# Altium schematic sheet IO.SchDoc
size A3
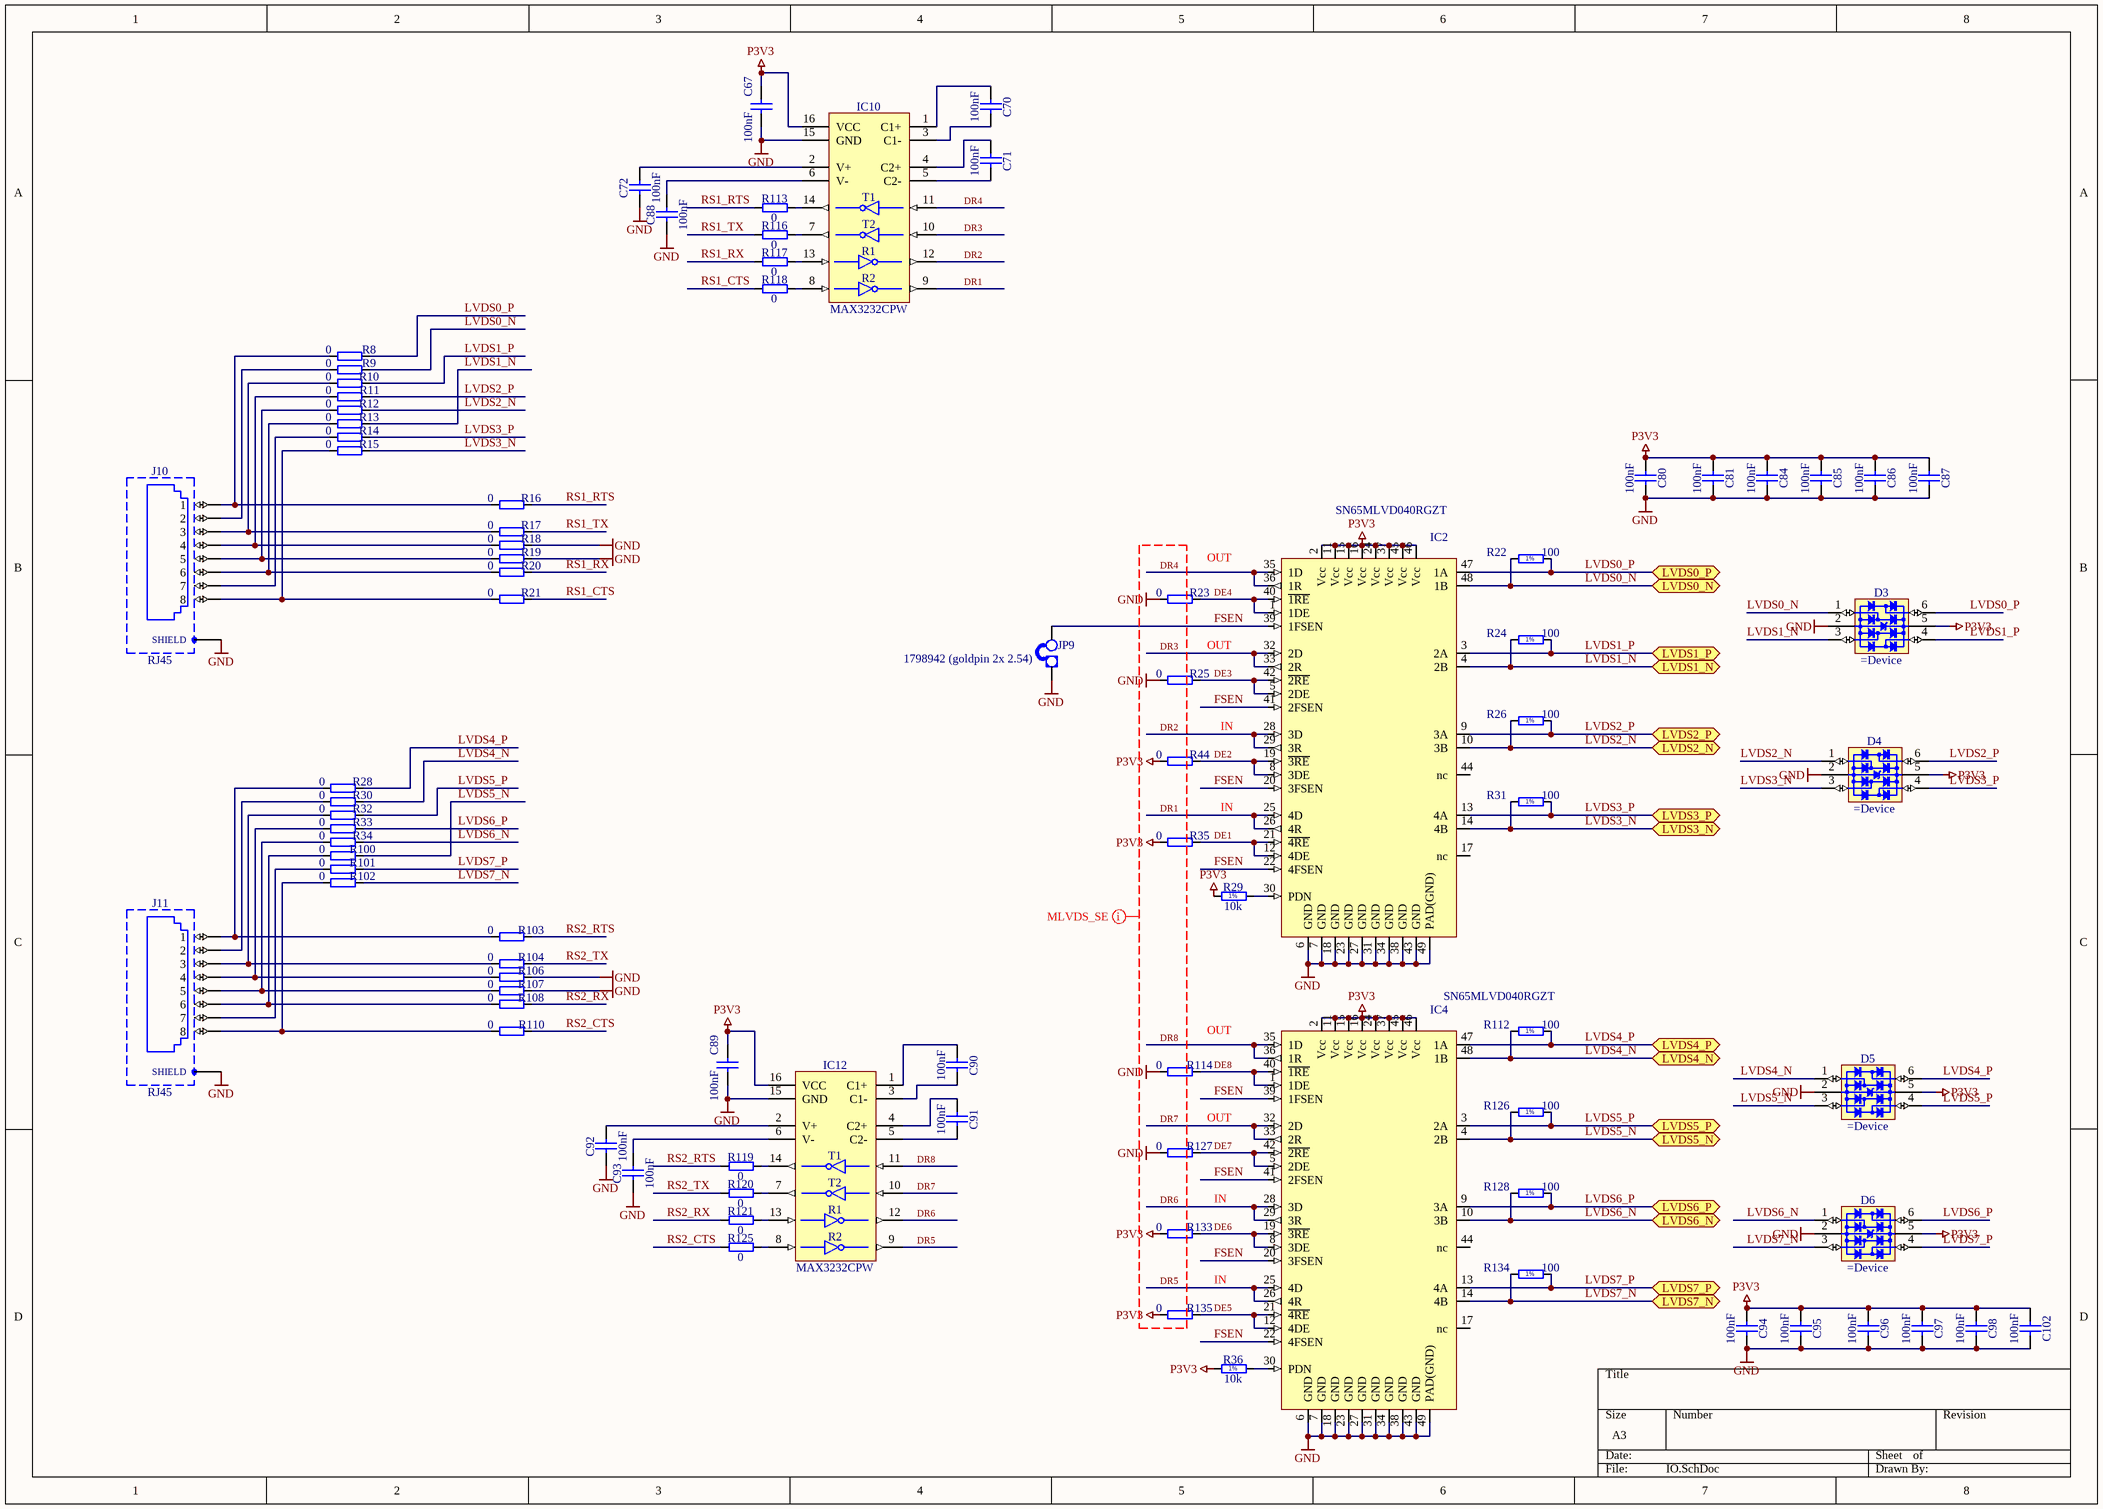
[diagram p0: IO.SchDoc]

## Parts
C67  100nF  [CAPC0603X33N]
C70  100nF  [CAPC1608X90N]
C71  100nF  [CAPC1608X90N]
C72  100nF  [CAPC1608X90N]
C80  100nF  [CAPC0603X33N]
C81  100nF  [CAPC0603X33N]
C84  100nF  [CAPC0603X33N]
C85  100nF  [CAPC0603X33N]
C86  100nF  [CAPC0603X33N]
C87  100nF  [CAPC0603X33N]
C88  100nF  [CAPC1608X90N]
C89  100nF  [CAPC0603X33N]
C90  100nF  [CAPC1608X90N]
C91  100nF  [CAPC1608X90N]
C92  100nF  [CAPC1608X90N]
C93  100nF  [CAPC1608X90N]
C94  100nF  [CAPC0603X33N]
C95  100nF  [CAPC0603X33N]
C96  100nF  [CAPC0603X33N]
C97  100nF  [CAPC0603X33N]
C98  100nF  [CAPC0603X33N]
C102  100nF  [CAPC0603X33N]
D3  (no value)  [SOTFL50P160X60-6N]
D4  (no value)  [SOTFL50P160X60-6N]
D5  (no value)  [SOTFL50P160X60-6N]
D6  (no value)  [SOTFL50P160X60-6N]
IC2  SN65MLVD040RGZT  [QFN48L]
IC4  SN65MLVD040RGZT  [QFN48L]
IC10  MAX3232CPW  [SOP65P640X120-16N]
IC12  MAX3232CPW  [SOP65P640X120-16N]
J10  RJ45  [FCI_95678-001LF]
J11  RJ45  [FCI_95678-001LF]
JP9  1798942 (goldpin 2x 2.54)  [jump]
R8  0  [RESC1005X40N]
R9  0  [RESC1005X40N]
R10  0  [RESC1005X40N]
R11  0  [RESC1005X40N]
R12  0  [RESC1005X40N]
R13  0  [RESC1005X40N]
R14  0  [RESC1005X40N]
R15  0  [RESC1005X40N]
R16  0  [RESC1005X40N]
R17  0  [RESC1005X40N]
R18  0  [RESC1005X40N]
R19  0  [RESC1005X40N]
R20  0  [RESC1005X40N]
R21  0  [RESC1005X40N]
R22  100  [RESC1005X40N]
R23  0  [RESC1005X40N]
R24  100  [RESC1005X40N]
R25  0  [RESC1005X40N]
R26  100  [RESC1005X40N]
R28  0  [RESC1005X40N]
R29  10k  [RESC1005X40N]
R30  0  [RESC1005X40N]
R31  100  [RESC1005X40N]
R32  0  [RESC1005X40N]
R33  0  [RESC1005X40N]
R34  0  [RESC1005X40N]
R35  0  [RESC1005X40N]
R36  10k  [RESC1005X40N]
R44  0  [RESC1005X40N]
R100  0  [RESC1005X40N]
R101  0  [RESC1005X40N]
R102  0  [RESC1005X40N]
R103  0  [RESC1005X40N]
R104  0  [RESC1005X40N]
R106  0  [RESC1005X40N]
R107  0  [RESC1005X40N]
R108  0  [RESC1005X40N]
R110  0  [RESC1005X40N]
R112  100  [RESC1005X40N]
R113  0  [RESC1005X40N]
R114  0  [RESC1005X40N]
R116  0  [RESC1005X40N]
R117  0  [RESC1005X40N]
R118  0  [RESC1005X40N]
R119  0  [RESC1005X40N]
R120  0  [RESC1005X40N]
R121  0  [RESC1005X40N]
R125  0  [RESC1005X40N]
R126  100  [RESC1005X40N]
R127  0  [RESC1005X40N]
R128  100  [RESC1005X40N]
R133  0  [RESC1005X40N]
R134  100  [RESC1005X40N]
R135  0  [RESC1005X40N]

## Ports
LVDS0_N (bidir), LVDS0_P (bidir), LVDS1_N (bidir), LVDS1_P (bidir), LVDS2_N (bidir), LVDS2_P (bidir), LVDS3_N (bidir), LVDS3_P (bidir), LVDS4_N (bidir), LVDS4_P (bidir), LVDS5_N (bidir), LVDS5_P (bidir), LVDS6_N (bidir), LVDS6_P (bidir), LVDS7_N (bidir), LVDS7_P (bidir)

## Nets
GND: C67.1 C72.2 C80.2 C81.2 C84.2 C85.2 C86.2 C87.2 C88.2 C89.1 C92.2 C93.2 C94.2 C95.2 C96.2 C97.2 C98.2 C102.2 D3.2(GND) D4.2(GND) D5.2(GND) D6.2(GND) IC2.6(GND) IC2.7(GND) IC2.18(GND) IC2.23(GND) IC2.27(GND) IC2.31(GND) IC2.34(GND) IC2.38(GND) IC2.43(GND) IC2.49(PAD(GND)) IC4.6(GND) IC4.7(GND) IC4.18(GND) IC4.23(GND) IC4.27(GND) IC4.31(GND) IC4.34(GND) IC4.38(GND) IC4.43(GND) IC4.49(PAD(GND)) IC10.15(GND) IC12.15(GND) J10.SHIELD J11.SHIELD JP9.1(E1) R18.2 R19.2 R23.1 R25.1 R106.2 R107.2 R114.1 R127.1
P3V3: C67.2 C80.1 C81.1 C84.1 C85.1 C86.1 C87.1 C89.2 C94.1 C95.1 C96.1 C97.1 C98.1 C102.1 D3.5(VBUS) D4.5(VBUS) D5.5(VBUS) D6.5(VBUS) IC2.2(Vcc) IC2.11(Vcc) IC2.15(Vcc) IC2.16(Vcc) IC2.24(Vcc) IC2.37(Vcc) IC2.45(Vcc) IC2.46(Vcc) IC4.2(Vcc) IC4.11(Vcc) IC4.15(Vcc) IC4.16(Vcc) IC4.24(Vcc) IC4.37(Vcc) IC4.45(Vcc) IC4.46(Vcc) IC10.16(VCC) IC12.16(VCC) R29.1 R35.1 R36.1 R44.1 R133.1 R135.1
DE1: IC2.12(4DE) IC2.21(~{4RE}) R35.2
DE2: IC2.8(3DE) IC2.19(~{3RE}) R44.2
DE3: IC2.5(2DE) IC2.42(~{2RE}) R25.2
DE4: IC2.1(1DE) IC2.40(~{1RE}) R23.2
DE5: IC4.12(4DE) IC4.21(~{4RE}) R135.2
DE6: IC4.8(3DE) IC4.19(~{3RE}) R133.2
DE7: IC4.5(2DE) IC4.42(~{2RE}) R127.2
DE8: IC4.1(1DE) IC4.40(~{1RE}) R114.2
DR1: IC2.25(4D) IC2.26(4R) IC10.9(R2OUT)
DR2: IC2.28(3D) IC2.29(3R) IC10.12(R1OUT)
DR3: IC2.32(2D) IC2.33(2R) IC10.10(T2IN)
DR4: IC2.35(1D) IC2.36(1R) IC10.11(T1IN)
DR5: IC4.25(4D) IC4.26(4R) IC12.9(R2OUT)
DR6: IC4.28(3D) IC4.29(3R) IC12.12(R1OUT)
DR7: IC4.32(2D) IC4.33(2R) IC12.10(T2IN)
DR8: IC4.35(1D) IC4.36(1R) IC12.11(T1IN)
FSEN: IC2.20(3FSEN) IC2.22(4FSEN) IC2.39(1FSEN) IC2.41(2FSEN) IC4.20(3FSEN) IC4.22(4FSEN) IC4.39(1FSEN) IC4.41(2FSEN) JP9.2(E2)
LVDS0_N: D3.1(I/O1) IC2.48(1B) R9.2 R22.1 ; port LVDS0_N
LVDS0_P: D3.6(I/O4) IC2.47(1A) R8.2 R22.2 ; port LVDS0_P
LVDS1_N: D3.3(I/O2) IC2.4(2B) R13.2 R24.1 ; port LVDS1_N
LVDS1_P: D3.4(I/O3) IC2.3(2A) R10.2 R24.2 ; port LVDS1_P
LVDS2_N: D4.1(I/O1) IC2.10(3B) R12.2 R26.1 ; port LVDS2_N
LVDS2_P: D4.6(I/O4) IC2.9(3A) R11.2 R26.2 ; port LVDS2_P
LVDS3_N: D4.3(I/O2) IC2.14(4B) R15.2 R31.1 ; port LVDS3_N
LVDS3_P: D4.4(I/O3) IC2.13(4A) R14.2 R31.2 ; port LVDS3_P
LVDS4_N: D5.1(I/O1) IC4.48(1B) R30.2 R112.1 ; port LVDS4_N
LVDS4_P: D5.6(I/O4) IC4.47(1A) R28.2 R112.2 ; port LVDS4_P
LVDS5_N: D5.3(I/O2) IC4.4(2B) R100.2 R126.1 ; port LVDS5_N
LVDS5_P: D5.4(I/O3) IC4.3(2A) R32.2 R126.2 ; port LVDS5_P
LVDS6_N: D6.1(I/O1) IC4.10(3B) R34.2 R128.1 ; port LVDS6_N
LVDS6_P: D6.6(I/O4) IC4.9(3A) R33.2 R128.2 ; port LVDS6_P
LVDS7_N: D6.3(I/O2) IC4.14(4B) R102.2 R134.1 ; port LVDS7_N
LVDS7_P: D6.4(I/O3) IC4.13(4A) R101.2 R134.2 ; port LVDS7_P
RS1_CTS: R21.2 R118.1
RS1_RTS: R16.2 R113.1
RS1_RX: R20.2 R117.1
RS1_TX: R17.2 R116.1
RS2_CTS: R110.2 R125.1
RS2_RTS: R103.2 R119.1
RS2_RX: R108.2 R121.1
RS2_TX: R104.2 R120.1
NetC70_1: C70.1 IC10.3(C1-)
NetC70_2: C70.2 IC10.1(C1+)
NetC71_1: C71.1 IC10.5(C2-)
NetC71_2: C71.2 IC10.4(C2+)
NetC72_1: C72.1 IC10.2(V+)
NetC88_1: C88.1 IC10.6(V-)
NetC90_1: C90.1 IC12.3(C1-)
NetC90_2: C90.2 IC12.1(C1+)
NetC91_1: C91.1 IC12.5(C2-)
NetC91_2: C91.2 IC12.4(C2+)
NetC92_1: C92.1 IC12.2(V+)
NetC93_1: C93.1 IC12.6(V-)
NetIC2_30: IC2.30(PDN) R29.2
NetIC4_30: IC4.30(PDN) R36.2
NetIC10_7: IC10.7(T2OUT) R116.2
NetIC10_8: IC10.8(R2IN) R118.2
NetIC10_13: IC10.13(R1IN) R117.2
NetIC10_14: IC10.14(T1OUT) R113.2
NetIC12_7: IC12.7(T2OUT) R120.2
NetIC12_8: IC12.8(R2IN) R125.2
NetIC12_13: IC12.13(R1IN) R121.2
NetIC12_14: IC12.14(T1OUT) R119.2
NetJ10_1: J10.1 R8.1 R16.1
NetJ10_2: J10.2 R9.1
NetJ10_3: J10.3 R10.1 R17.1
NetJ10_4: J10.4 R11.1 R18.1
NetJ10_5: J10.5 R12.1 R19.1
NetJ10_6: J10.6 R13.1 R20.1
NetJ10_7: J10.7 R14.1
NetJ10_8: J10.8 R15.1 R21.1
NetJ11_1: J11.1 R28.1 R103.1
NetJ11_2: J11.2 R30.1
NetJ11_3: J11.3 R32.1 R104.1
NetJ11_4: J11.4 R33.1 R106.1
NetJ11_5: J11.5 R34.1 R107.1
NetJ11_6: J11.6 R100.1 R108.1
NetJ11_7: J11.7 R101.1
NetJ11_8: J11.8 R102.1 R110.1

Not connected (* = marked no-connect by the designer): IC2 17(nc) 44(nc); IC4 17(nc) 44(nc)

## Layout directives
net class MLVDS_SE: DR1, DR2, DR3, DR4, DR5, DR6, DR7, DR8, GND, P3V3

## Notes on the sheet
- OUT
- IN
- (in symbol MAX3232CPW) T1; T2; R1; R2
- (in symbol R0402_10K_1%_0.0625W_100PPM) 1%
- (in symbol R0402_100R_1%_0.0625W_100PPM) 1%

## Library data of the parts
C67 C80 C81 C84-C87 C89 C94-C98 C102 = CC0201_100NF_6.3V_10%_X5R: Non-polarised capacitor; Part Description: SMD Multilayer Chip Ceramic Capacitor; Manufacturer: GENERIC; Manufacturer1 Part Number: 02016D104KAT2A; Voltage: 6.3V; TC: X5R; Tolerance: ±10%; Table: Capacitors SMD; Part Number: CC0201_100NF_6.3V_10%_X5R; Component Kind: Standard; Component Type: Standard; Pin Count: 2; Value: 100nF; Status: Not Recommended; Manufacturer Part Number: CC0201_100NF_6.3V_10%_X5R; Case: 0201; Mounted: Yes; Socket: No; SMD: Yes; Manufacturer1 Example: AVX; Manufacturer1 ComponentHeight: 0.33mm; HelpURL: \\cern.ch\dfs\Applications\Altium\Datasheets\CC0201_X5R_AVX.pdf; Author: CERN DEM JLC; CreateDate: 2007-12-03; LatestRevisionDate: 2007-12-03
C70-C72 C88 C90-C93 = CC0603_100NF_100V_10%_X7R: Non-polarised capacitor; Part Description: SMD Multilayer Chip Ceramic Capacitor; Manufacturer: GENERIC; Manufacturer1 Part Number: GRM188R72A104KA35D; Voltage: 100V; TC: X7R; Tolerance: ±10%; Table: Capacitors SMD; Part Number: CC0603_100NF_100V_10%_X7R; Component Kind: Standard; Component Type: Standard; Pin Count: 2; Value: 100nF; Status: None; Manufacturer Part Number: CC0603_100NF_100V_10%_X7R; Case: 0603; Mounted: Yes; Socket: No; SMD: Yes; Manufacturer1 Example: MURATA; Manufacturer1 ComponentHeight: 0.9mm; HelpURL: \\cern.ch\dfs\Applications\Altium\Datasheets\CC0603_MURATA_GRM188R72A104KA35D.pdf; Author: CERN DEM JLC; CreateDate: 2013-12-11; LatestRevisionDate: 2013-12-11
D3-D6 = NUP4114UPXV6T1G: Part Number: NUP4114UPXV6T1G
IC2 IC4 = IFC_SN65MLVD040
IC10 IC12 = MAX3232CPW: 3-V To 5.5-V Multichannel RS-232 Line Driver/Receiver With ±15kV IEC ESD Protection; Part Description: 3V To 5.5V Multichannel RS-232 Line Driver/Receiver With ±15kV IEC ESD Protection; Manufacturer: TEXAS INSTRUMENTS; Table: Analog & Interface; Part Number: MAX3232CPW; Component Kind: Standard; Component Type: Standard; Device: MAX3232CPW; PackageDescription: SOP, 0.65mm pitch; 16 pin, 4.40mm W X 5.00mm L X 1.20mm H body IPC Medium Density; Manufacturer Part Number: MAX3232CPW; Pin Count: 16; Case: TSSOP16; Mounted: Yes; Socket: No; SMD: Yes; ComponentHeight: 1.2mm; Author: CERN DEM JLC; HelpURL: \\cern.ch\dfs\Applications\Altium\Datasheets\MAX3232CPW.pdf; CreateDate: 2012-01-09; LatestRevisionDate: 2012-01-10
J10 J11 = FCI_95678-001LF: 1 Port, 8 Positions Shielded Snap PEG, CAT5 RJ45 Horizontal Modular Jack; Manufacturer: FCI; PressFit: No; Part Number: FCI_95678-001LF; Component Kind: Standard; Component Type: Standard; Pin Count: 10; Family: RJ45; Mounted: Yes; Socket: No; SMD: No; Sense: No; Status: None; Part Description: 1 Port, 8 Positions Shielded Snap PEG, CAT5 RJ45 Horizontal Modular Jack; Manufacturer Part Number: 95678-001LF; ComponentHeight: 13.99mm; HelpURL: \\cern.ch\dfs\Applications\Altium\Datasheets\FCI_95678-001LF.pdf; Author: CERN DEM BC; CreateDate: 28.07.2015; LatestRevisionDate: 28.07.2015
JP9 = JUMPER: Supplier 1: Farnell; Supplier Part Number 1: 1798942
R8-R21 R23 R25 R28 R30 R32-R35 R44 R100-R104 R106-R108 R110 R113 R114 R116-R121 R125 R127 R133 R135 = R0402_0R_JUMPER: Resistor; Part Description: 1A (0.05R Max DC Resistance) Zero Ohm Jumper; Manufacturer: GENERIC; Manufacturer1 Part Number: 232270591001L; Table: Resistors SMD; Part Number: R0402_0R_JUMPER; Component Kind: Standard; Component Type: Standard; Pin Count: 2; Value: 0; Status: Not recommended; Manufacturer Part Number: R0402_0R_JUMPER; Case: 0402; Mounted: Yes; Socket: No; SMD: Yes; Manufacturer1 Example: YAGEO PHYCOMP; Manufacturer1 ComponentHeight: 0.4mm; HelpURL: \\cern.ch\dfs\Applications\Altium\Datasheets\R0402_Phycomp_RC0402.pdf; Author: CERN DEM JLC; CreateDate: 2007-12-03; LatestRevisionDate: 2012-10-17
R22 R24 R26 R31 R112 R126 R128 R134 = R0402_100R_1%_0.0625W_100PPM: Resistor - 1%; Part Description: General Purpose Thick Film Chip Resistor; Manufacturer: GENERIC; Manufacturer1 Part Number: 232270671001L; TC: ±100ppm/°C; Table: Resistors SMD; Part Number: R0402_100R_1%_0.0625W_100PPM; Component Kind: Standard; Component Type: Standard; Pin Count: 2; Value: 100; Status: Not recommended; Power: 0.0625W; Tolerance: ±1%; Manufacturer Part Number: R0402_100R_1%_0.0625W_100PPM; Case: 0402; Mounted: Yes; Socket: No; SMD: Yes; Manufacturer1 Example: YAGEO PHYCOMP; Manufacturer1 ComponentHeight: 0.4mm; HelpURL: \\cern.ch\dfs\Applications\Altium\Datasheets\R0402_Phycomp_RC0402.pdf; Author: CERN DEM JLC; CreateDate: 2007-12-03; LatestRevisionDate: 2012-10-17
R29 R36 = R0402_10K_1%_0.0625W_100PPM: Resistor - 1%; Part Description: General Purpose Thick Film Chip Resistor; Manufacturer: GENERIC; Manufacturer1 Part Number: 232270671003L; TC: ±100ppm/°C; Table: Resistors SMD; Part Number: R0402_10K_1%_0.0625W_100PPM; Component Kind: Standard; Component Type: Standard; Pin Count: 2; Value: 10k; Status: Not recommended; Power: 0.0625W; Tolerance: ±1%; Manufacturer Part Number: R0402_10K_1%_0.0625W_100PPM; Case: 0402; Mounted: Yes; Socket: No; SMD: Yes; Manufacturer1 Example: YAGEO PHYCOMP; Manufacturer1 ComponentHeight: 0.4mm; HelpURL: \\cern.ch\dfs\Applications\Altium\Datasheets\R0402_Phycomp_RC0402.pdf; Author: CERN DEM JLC; CreateDate: 2007-12-03; LatestRevisionDate: 2012-10-17